# Altium project LinReg5_3V3.PrjPcb
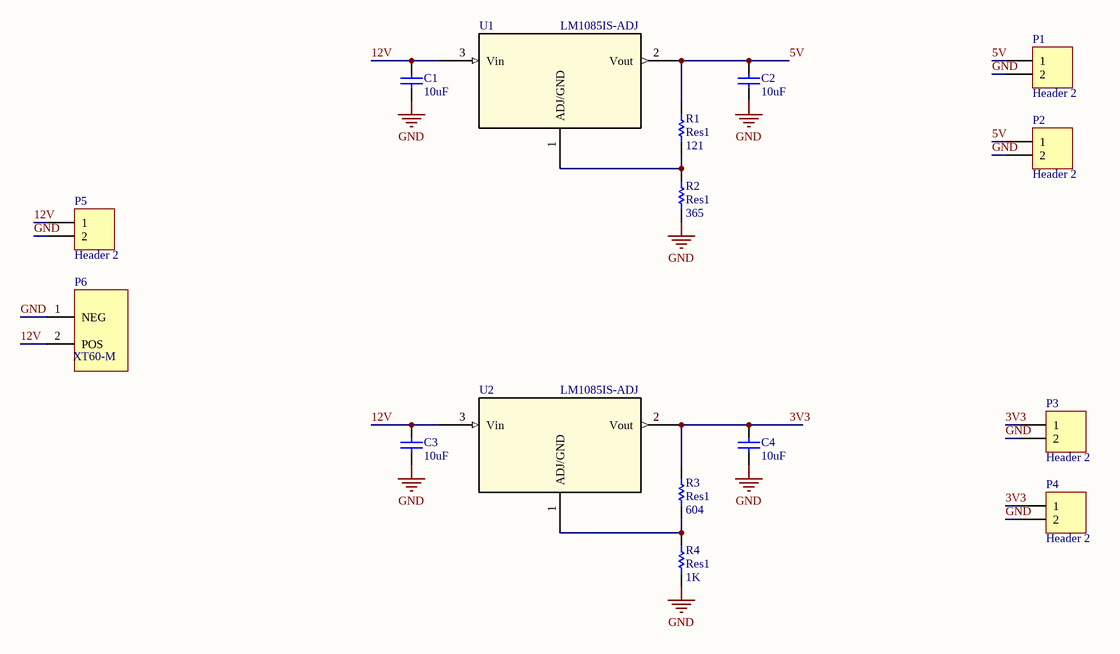
[diagram p0: LinReg5_3V3.SchDoc]
1 sheet, 16 parts. Net scope: global (net labels, ports and power ports of the same name join across sheets).
Board file: LinReg5_3V3.PcbDoc

## Sheet LinReg5_3V3.SchDoc: 3V3/5V Linear Regulator
size A4; Author: Benjamin Dyer; Organization: University of Guelph; Address1: 50 Stone Rd. E.; Address2: Guelph, Ontario; Address3: N1G 2M7; DocumentNumber: 1; Revision: 0.1; SheetNumber: 1; SheetTotal: 1

### Parts
C1  10uF  [1206]
C2  10uF  [1206]
C3  10uF  [1206]
C4  10uF  [1206]
P1  Header 2  [HDR1X2]
P2  Header 2  [HDR1X2]
P3  Header 2  [HDR1X2]
P4  Header 2  [HDR1X2]
P5  Header 2  [HDR1X2]
P6  XT60-M  [*AMASS_XT60-M]
R1  Res1  value 121  [6-0805_N]
R2  Res1  value 365  [6-0805_N]
R3  Res1  value 604  [6-0805_N]
R4  Res1  value 1K  [6-0805_N]
U1  LM1085IS-ADJ  [TS3B]
U2  LM1085IS-ADJ  [TS3B]

### Nets
GND: C1.1 C2.1 C3.1 C4.1 P1.2 P2.2 P3.2 P4.2 P5.2 P6.1(NEG) R2.1 R4.1
3V3: C4.2 P3.1 P4.1 R3.2 U2.2(Vout)
5V: C2.2 P1.1 P2.1 R1.2 U1.2(Vout)
12V: C1.2 C3.2 P5.1 P6.2(POS) U1.3(Vin) U2.3(Vin)
NetR1_1: R1.1 R2.2 U1.1(ADJ/GND)
NetR3_1: R3.1 R4.2 U2.1(ADJ/GND)

### Notes on the sheet
- Title
- Size:
- Date:
- A4
- Number:
- Time:
- Revision:
- Sheet
- of
- File:

### Library data of the parts
C1-C4 = Cap: Capacitor; Published: 8-Jun-2000; LatestRevisionDate: 17-Jul-2002; LatestRevisionNote: Re-released for DXP Platform.; PackageReference: RAD-0.3; Publisher: Altium Limited; PackageDescription: Radial Cap, Thru-Hole; 2 Leads; 0.3 in Pin Spacing
P1-P5 = Header 2: Header, 2-Pin; LatestRevisionDate: 17-Jul-2002; LatestRevisionNote: Re-released for DXP Platform.; Publisher: Altium Limited
P6 = XT60-M: Plug; DC supply; XT60; male; PIN: 2; for cable; soldered; 30A; 500V; MF: AMASS; Availability: Unavailable; Package: Package Analog Devices; MP: XT60-M; Price: None; SnapEDA_Link: https://www.snapeda.com/parts/XT60-M/AMASS/view-part/2883912/?ref=snap; Value: *
R1-R4 = Res1: Resistor; Published: 8-Jun-2000; LatestRevisionDate: 17-Jul-2002; LatestRevisionNote: Re-released for DXP Platform.; PackageReference: AXIAL-0.3; Publisher: Altium Limited; PackageDescription: Axial Device, Thru-Hole; 2 Leads; 0.3 in Pin Spacing
U1 U2 = LM1085IS-ADJ/NOP: No Description Available; Manufacturer_Part_Number: LM1085IS-ADJ/NOPB; Built_By: EMA_UL_Team; Vendor: Texas Instruments; Copyright: Copyright (C) 2018 Accelerated Designs. All rights reserved; RefDes: RefDes; Type: DEV; Value: Value